# EAGLE design mixer_board_input_and_mute_circuit (EAGLE 9.4.1)
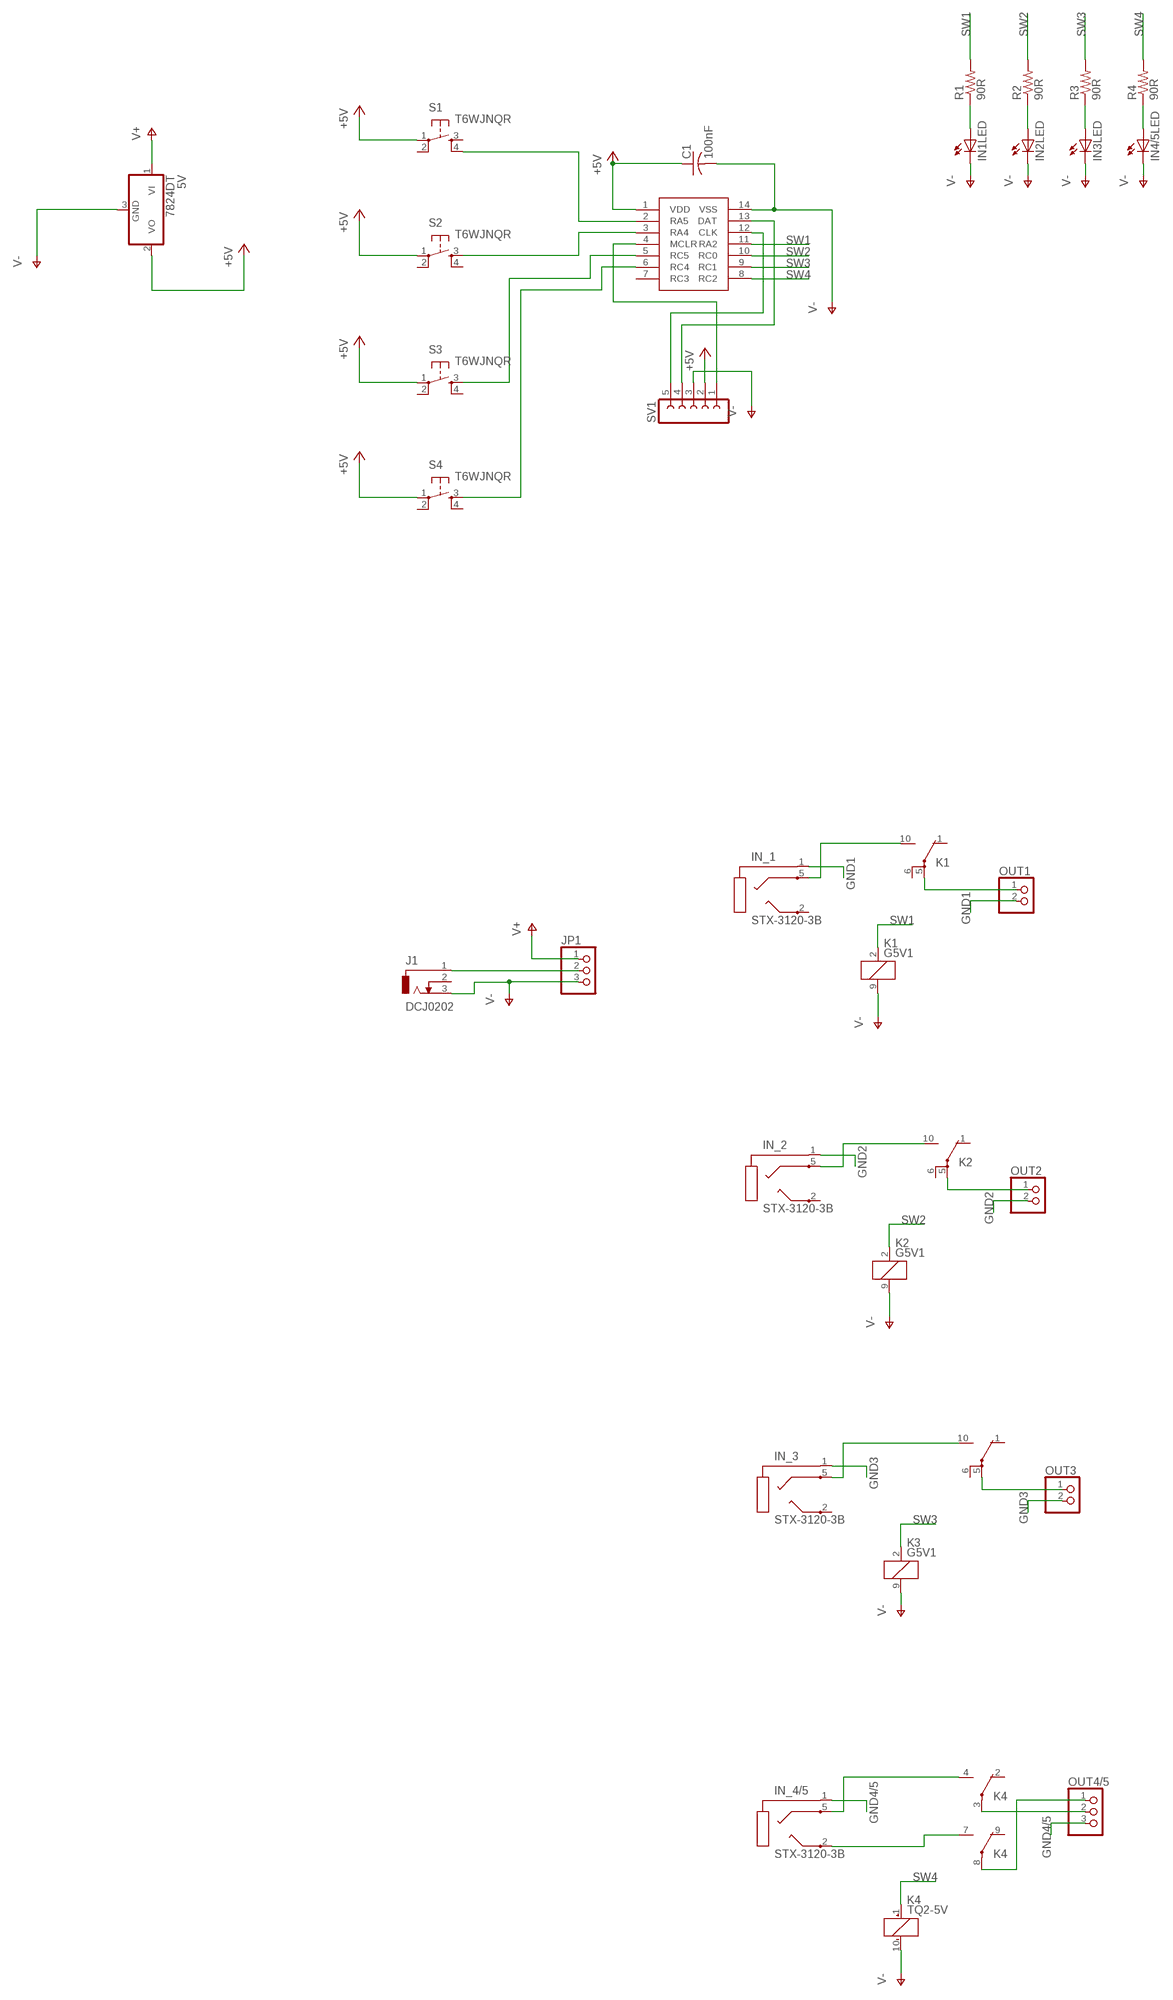
[diagram p0: schematic, sheet 1]

## Parts
5V  7824DT  [TO252]
C1  100nF  C-USC0805  [C0805]
IN1LED  LEDCHIPLED_1206  [CHIPLED_1206]
IN2LED  LEDCHIPLED_1206  [CHIPLED_1206]
IN3LED  LEDCHIPLED_1206  [CHIPLED_1206]
IN4/5LED  LEDCHIPLED_1206  [CHIPLED_1206]
IN_1  STX-3120-3B  [STX-3120]
IN_2  STX-3120-3B  [STX-3120]
IN_3  STX-3120-3B  [STX-3120]
IN_4/5  STX-3120-3B  [STX-3120]
J1  DCJ0202  [DCJ0202]
JP1  PINHD-1X3/90  [1X03/90]
K1  G5V1  [G5V1]
K2  G5V1  [G5V1]
K3  G5V1  [G5V1]
K4  TQ2-5V  [TQ2]
OUT1  PINHD-1X2/90  [1X02/90]
OUT2  PINHD-1X2/90  [1X02/90]
OUT3  PINHD-1X2/90  [1X02/90]
OUT4/5  PINHD-1X3/90  [1X03/90]
R1  90R  R-US_M0805  [M0805]
R2  90R  R-US_M0805  [M0805]
R3  90R  R-US_M0805  [M0805]
R4  90R  R-US_M0805  [M0805]
S1  T6WJNQR  [T6WJ2NGQR]
S2  T6WJNQR  [T6WJ2NGQR]
S3  T6WJNQR  [T6WJ2NGQR]
S4  T6WJNQR  [T6WJ2NGQR]
SV1  FE05-1  [FE05-1]
U1  PIC16F18426  [SO14]

## Nets
+5V: 5V.2(VO) C1.1 S1.1 S2.1 S3.1 S4.1 SV1.2 U1.1(VDD)
GND1: IN_1.1 OUT1.2
GND2: IN_2.1 OUT2.2
GND3: IN_3.1 OUT3.2
GND4/5: IN_4/5.1 OUT4/5.3
N$1: J1.1 JP1.2
N$2: K4.3(1:P) OUT4/5.2
N$3: S1.4 U1.2(RA5)
N$4: S2.3 U1.3(RA4)
N$5: K2.5(2:P) OUT2.1
N$6: K1.5(2:P) OUT1.1
N$7: K3.5(2:P) OUT3.1
N$8: S3.3 U1.5(RC5)
N$9: IN1LED.A R1.1
N$10: S4.3 U1.6(RC4)
N$11: SV1.1 U1.4(MCLR)
N$12: IN_4/5.5 K4.4(1:S)
N$13: IN_4/5.2 K4.7(2:S)
N$14: K4.8(2:P) OUT4/5.1
N$28: IN2LED.A R2.1
N$32: IN3LED.A R3.1
N$34: IN4/5LED.A R4.1
N$40: SV1.4 U1.13(DAT)
N$41: SV1.5 U1.12(CLK)
N$43: IN_3.5 K3.10(2:S)
N$44: IN_2.5 K2.10(2:S)
N$45: IN_1.5 K1.10(2:S)
SW1: K1.2 R1.2 U1.11(RA2)
SW2: K2.2 R2.2 U1.10(RC0)
SW3: K3.2 R3.2 U1.9(RC1)
SW4: K4.1(_:+) R4.2 U1.8(RC2)
V+: 5V.1(VI) JP1.1
V-: 5V.3(GND) C1.2 IN1LED.C IN2LED.C IN3LED.C IN4/5LED.C J1.3 JP1.3 K1.9 K2.9 K3.9 K4.10(_:-) SV1.3 U1.14(VSS)
Unconnected: IN_1.2 IN_2.2 IN_3.2 J1.2 K1.1(2:O) K1.6(2:P) K2.1(2:O) K2.6(2:P) K3.1(2:O) K3.6(2:P) K4.2(1:O) K4.9(2:O) S1.2 S1.3 S2.2 S2.4 S3.2 S3.4 S4.2 S4.4 U1.7(RC3)

## Library data of the parts
5V = linear:78*: Positive VOLTAGE REGULATOR Source: http://cache.national.com/ds/LM/LM78L05.pdf http://www.fairchildsemi.com/ds/LM/LM7805.pdf
C1 = resistor:C-US: CAPACITOR, American symbol
IN1LED IN2LED IN3LED IN4/5LED = led:LED: LED OSRAM: - CHIPLED LG R971, LG N971, LY N971, LG Q971, LY Q971, LO R971, LY R971 LH N974, LH R974 LS Q976, LO Q976, LY Q976 LO Q996 - Hyper CHIPLED LW Q18S LB Q993, LB Q99A, LB R99A - SideLED LS A670, LO A670, LY A670, LG A670, LP A670 LB A673, LV A673, LT A673, LW A673 LH A674 LY A675 LS A676, LA A676, LO A676, LY A676, LW A676 LS A679, LY A679, LG A679 - Hyper Micro SIDELED® LS Y876, LA Y876, LO Y876, LY Y876 LT Y87S - SmartLED LW L88C, LW L88S LB L89C, LB L89S, LG L890 LS L89K, LO L89K, LY L89K LS L896, LA L896, LO L896, LY L896 - TOPLED LS T670, LO T670, LY T670, LG T670, LP T670 LSG T670, LSP T670, LSY T670, LOP T670, LYG T670 LG T671, LOG T671, LSG T671 LB T673, LV T673, LT T673, LW T673 LH T674 LS T676, LA T676, LO T676, LY T676, LB T676, LH T676, LSB T676, LW T676 LB T67C, LV T67C, LT T67C, LS T67K, LO T67K, LY T67K, LW E67C LS E67B, LA E67B, LO E67B, LY E67B, LB E67C, LV E67C, LT E67C LW T67C LS T679, LY T679, LG T679 LS T770, LO T770, LY T770, LG T770, LP T770 LB T773, LV T773, LT T773, LW T773 LH T774 LS E675, LA E675, LY E675, LS T675 LS T776, LA T776, LO T776, LY T776, LB T776 LHGB T686 LT T68C, LB T68C - Hyper Mini TOPLED® LB M676 - Mini TOPLED Santana® LG M470 LS M47K, LO M47K, LY M47K Source: http://www.osram.convergy.de LUXEON: - LUMILED® LXK2-PW12-R00, LXK2-PW12-S00, LXK2-PW14-U00, LXK2-PW14-V00 LXK2-PM12-R00, LXK2-PM12-S00, LXK2-PM14-U00 LXK2-PE12-Q00, LXK2-PE12-R00, LXK2-PE12-S00, LXK2-PE14-T00, LXK2-PE14-U00 LXK2-PB12-K00, LXK2-PB12-L00, LXK2-PB12-M00, LXK2-PB14-N00, LXK2-PB14-P00, LXK2-PB14-Q00 LXK2-PR12-L00, LXK2-PR12-M00, LXK2-PR14-Q00, LXK2-PR14-R00 LXK2-PD12-Q00, LXK2-PD12-R00, LXK2-PD12-S00 LXK2-PH12-R00, LXK2-PH12-S00 LXK2-PL12-P00, LXK2-PL12-Q00, LXK2-PL12-R00 Source: www.luxeon.com KINGBRIGHT: KA-3528ASYC Source: www.kingbright.com
IN_1-IN_3 IN_4/5 = biblib:STX-3120-3B
J1 = con-jack:DCJ0202: DC POWER JACK Source: DCJ0202.pdf; OC_FARNELL: unknown; OC_NEWARK: unknown
JP1 OUT4/5 = pinhead:PINHD-1X3: PIN HEADER
K1-K3 = relay:G5V1: RELAY 1 x switch, 0.5 A/125 V AC, 1 A/24 V DC , Omron; MPN: G5V-1-DC24; OC_FARNELL: 9949593; OC_NEWARK: 36M6377
K4 = relay:TQ2?*: LOW PROFILE 2 FORM C RELAY NAiS Source: http://www.mew-europe.com/.. en_ds_61020_0001.pdf Source: http://www.mew-europe.com/.. en_ds_61020_0004.pdf; MF: AROMAT/ MATSUSHITA; MPN: TQ2-5V; OC_FARNELL: 1175716; OC_NEWARK: 64K3200
OUT1-OUT3 = pinhead:PINHD-1X2: PIN HEADER
R1-R4 = resistor:R-US_: RESISTOR, American symbol
S1-S4 = biblib:T6WJNQR
SV1 = con-lsta:FE05-1: FEMALE HEADER; OC_FARNELL: unknown; OC_NEWARK: unknown
U1 = biblib:PIC16F18426

## Board
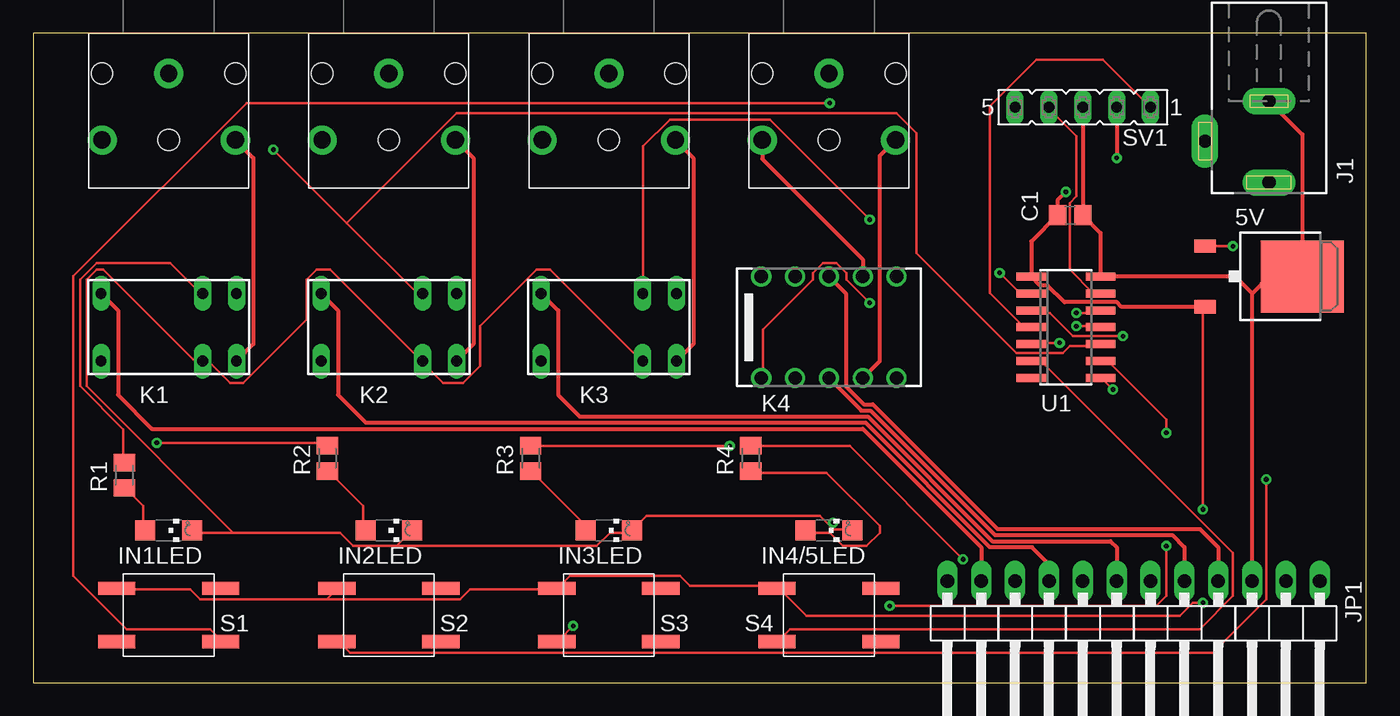
[diagram p1: board, top side]
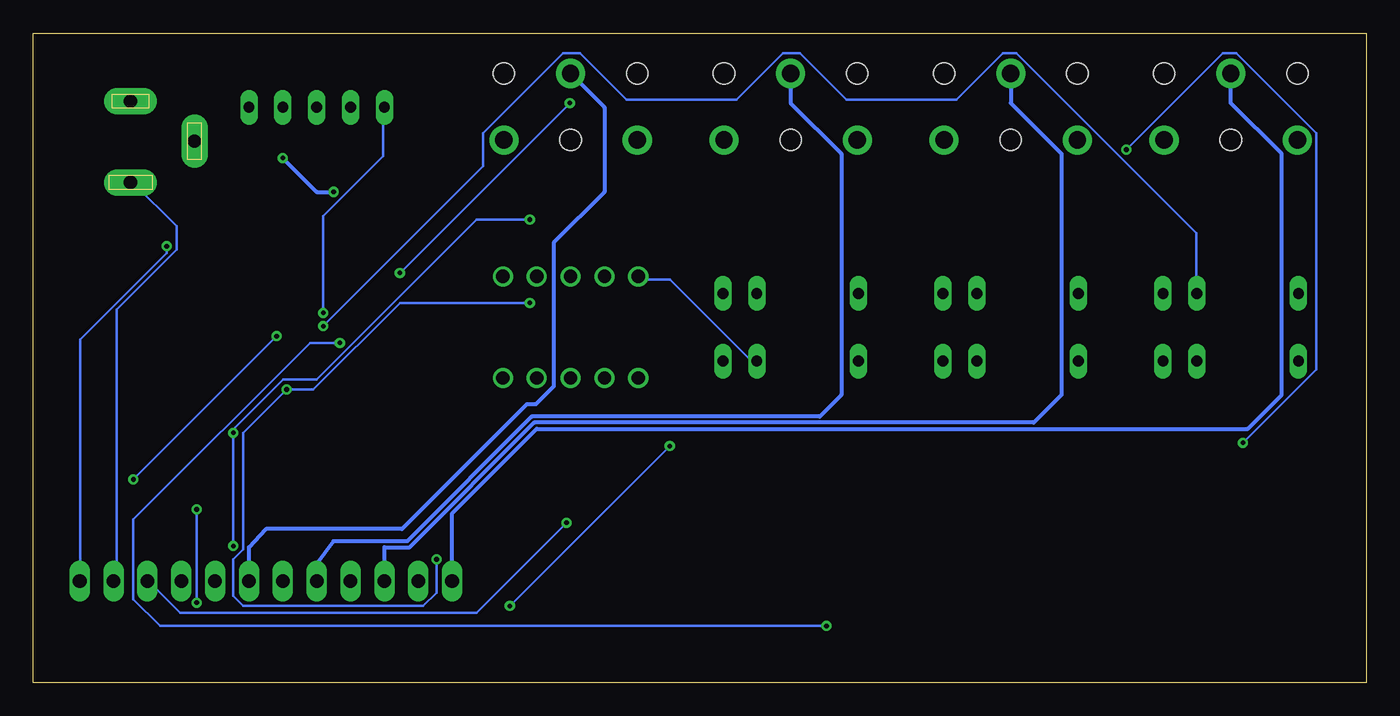
[diagram p2: board, bottom side, seen from below]

Size 100 x 48.73 mm. Coordinates in mm from the lower left corner, seen from the top.
Outline: 0,0 100,0 100,48.73 0,48.73 0,0
Copper layers (1*16): Top 0.035mm / dielectric 1.5mm / Bottom 0.035mm
Design rules "default *": minimum track width 0.2mm, minimum drill 0.35mm, track to track 6mil, track to pad 6mil, pad to pad 6mil, via to via 6mil, smd to smd 6mil, copper to edge 40mil, drill to drill 6mil, minimum pad ring 10mil, minimum via ring 8mil, stop-mask expansion 4mil, vias tented up to drill 0mil, thermal gap 10mil

### Footprints (pad centres in the part's own frame; a part is rotated, then mirrored left to right if it is on the bottom)
TO252 = smd 1 x 1.6: 1 -2.28,-4.8; 2 2.28,-4.8 | smd 5.4 x 6.2: 3 0,2.5
C0805 = smd 1.3 x 1.5: 1 -0.95,0; 2 0.95,0
CHIPLED_1206 = smd 1.5 x 1.5: A 0,-1.75; C 0,1.75
STX-3120 = drill 1.3 pad 2.184: 1 0,0; 2 5,-5; 5 5,5 | hole 1.6: 0,5; 0,-5; 5,0
DCJ0202 = drill 1 pad 2 long: 1 0,3.1; 2 4.8,0; 3 0,-3
1X03/90 = drill 1.016 long: 1 -2.54,-3.81; 2 0,-3.81; 3 2.54,-3.81
G5V1 = drill 0.813 long: 1 -5.08,-2.54; 2 -2.54,-2.54; 5 5.08,-2.54; 6 5.08,2.54; 9 -2.54,2.54; 10 -5.08,2.54
TQ2 = drill 1: 1 -5.08,-3.81; 2 -2.54,-3.81; 3 0,-3.81; 4 2.54,-3.81; 5 5.08,-3.81; 6 5.08,3.81; 7 2.54,3.81; 8 0,3.81; 9 -2.54,3.81; 10 -5.08,3.81
1X02/90 = drill 1.016 long: 1 -1.27,-3.81; 2 1.27,-3.81
M0805 = smd 1.3 x 1.6: 1 -0.95,0; 2 0.95,0
T6WJ2NGQR = smd 2.8 x 1: 1 -3.9,2; 2 3.9,2; 3 -3.9,-2; 4 3.9,-2
FE05-1 = drill 0.813 long: 1 -5.08,0; 2 -2.54,0; 3 0,0; 4 2.54,0; 5 5.08,0
SO14 = smd 0.6 x 2.2: 1 -3.81,-2.6; 2 -2.54,-2.6; 3 -1.27,-2.6; 4 0,-2.6; 5 1.27,-2.6; 6 2.54,-2.6; 7 3.81,-2.6; 8 3.81,2.6; 9 2.54,2.6; 10 1.27,2.6; 11 0,2.6; 12 -1.27,2.6; 13 -2.54,2.6; 14 -3.81,2.6

### Placement (x,y rotation side)
5V  92.71,30.48 270 top
C1  77.79,35.08 0 top
IN1LED  10.16,11.43 270 top
IN2LED  26.67,11.43 270 top
IN3LED  43.18,11.43 270 top
IN4/5LED  59.69,11.43 270 top
IN_1  10.16,45.72 270 top
IN_2  26.67,45.72 270 top
IN_3  43.18,45.72 270 top
IN_4/5  59.69,45.72 270 top
J1  92.71,40.64 180 top
JP1  93.98,3.81 180 top
K1  10.16,26.67 180 top
K2  26.67,26.67 180 top
K3  43.18,26.67 180 top
K4  59.69,26.67 0 top
OUT1  69.85,3.81 180 top
OUT2  74.93,3.81 180 top
OUT3  80.01,3.81 180 top
OUT4/5  86.36,3.81 180 top
R1  6.83,15.56 90 top
R2  22.07,16.83 90 top
R3  37.31,16.83 90 top
R4  53.82,16.83 90 top
S1  10.16,5.08 0 top
S2  26.67,5.08 0 top
S3  43.18,5.08 0 top
S4  59.69,5.08 0 top
SV1  78.74,43.18 180 top
U1  77.47,26.67 270 top

### Tracks (layer width: path | path; a pad name or v marks a point on that pad's centre or on a via)
+5V  (via drill 0.35)
  Top 0.2: 22,6.25 12.5,6.25 11.75,7 6.5,7 S1.1 | 22,6.25 22.75,7 S2.1 | 22,6.25 32,6.25 32.75,7 39.25,7 S3.1 39.5,7.25 40.25,8 48.5,8 49.25,7.25 55.75,7.25 S4.1 56,7 58,5 86,5 87,6 v87.75,6 | v87.75,13 87.75,28 5V.2
  Top 0.305: 5V.2 81.64,28.2 81.3,28.55 77.37,28.55 76.1,29.82 75.53,29.82 U1.1 74.87,33.11 C1.1 76.84,36.2 v77.47,36.83 | SV1.2 v81.28,39.37
  Bottom 0.2: v87.75,6 v87.75,13
  Bottom 0.305: v81.28,39.37 78.74,36.83 v77.47,36.83
GND1
  Bottom 0.305: IN_1.1 10.16,43.5 6.35,39.69 6.35,21.59 8.89,19.05 62.23,19.05 68.58,12.7 OUT1.2
GND2
  Bottom 0.305: IN_2.1 26.67,43.5 22.86,39.69 22.86,21.59 24.94,19.51 62.42,19.51 71.77,10.16 73.66,10.16 OUT2.2
GND3
  Bottom 0.305: IN_3.1 43.18,43.5 39.37,39.69 39.37,21.59 41,19.96 62.61,19.96 71.96,10.62 77.47,10.62 78.74,8.89 OUT3.2
GND4/5
  Bottom 0.305: IN_4/5.1 57.15,43.18 57.15,36.83 60.96,33.02 60.96,22.24 62.32,20.88 62.99,20.88 72.33,11.53 82.55,11.53 83.82,10.16 OUT4/5.3
N$1
  Bottom 0.2: JP1.2 93.75,7.75 93.75,28 89.25,32.5 89.25,34.25 92.5,37.5 J1.1
N$2
  Top 0.305: K4.3 62.13,20.42 62.8,20.42 72.14,11.07 85.45,11.07 86.36,10.16 OUT4/5.2
N$3  (via drill 0.35)
  Top 0.2: v72.5,30.75 74,29.25 74.75,29.25 U1.2 | v59.75,43.5 16,43.5 3,30.5 3,8 7,4 13.25,4 14,3.25 S1.4
  Bottom 0.2: v59.75,43.5 v72.5,30.75
N$4  (via drill 0.35)
  Top 0.2: v81.75,26 78,26 76.25,27.75 75,27.75 U1.3 | v92.5,15.25 92.5,6.25 88.5,2.25 23.75,2.25 23,3 S2.3
  Bottom 0.2: v92.5,15.25 v81.75,26
N$5
  Top 0.305: K2.5 22.86,27.94 22.86,21.59 24.94,19.51 62.42,19.51 71.77,10.16 74.93,10.16 76.2,8.89 OUT2.1
N$6
  Top 0.305: K1.5 6.35,27.94 6.35,21.59 8.89,19.05 62.23,19.05 71.12,10.16 OUT1.1
N$7
  Top 0.305: K3.5 39.37,27.94 39.37,21.59 41,19.96 62.61,19.96 71.96,10.62 80.82,10.62 81.28,10.16 OUT3.1
N$8  (via drill 0.35)
  Top 0.2: v77,25.5 75,25.5 U1.5 | v40.5,4.25 39.5,3.25 S3.3
  Bottom 0.2: v77,25.5 79.25,25.5 92.5,12.25 92.5,6.25 90.5,4.25 v40.5,4.25
N$9
  Top 0.2: IN1LED.A 8.25,11.5 8.25,13.25 7,14.5 R1.1
N$10
  Top 0.2: U1.6 75,24 75.75,24 90,9.75 90,6.5 87.5,4 56.75,4 56,3.25 S4.3
N$11
  Top 0.2: SV1.1 80.25,46.75 75.25,46.75 71.75,43.25 71.75,29.25 74.25,26.75 74.75,26.75 U1.4
N$12
  Top 0.305: K4.4 63.5,24.13 63.5,39.53 IN_4/5.5
N$13
  Top 0.305: IN_4/5.2 54.69,39.29 62.23,31.75 K4.7
N$14
  Top 0.305: K4.8 60.96,29.21 60.96,22.24 62.32,20.88 62.99,20.88 72.33,11.53 87.53,11.53 88.9,10.16 OUT4/5.1
N$28
  Top 0.2: IN2LED.A 24.75,11.5 24.75,13.25 22.25,15.75 R2.1
N$32
  Top 0.2: IN3LED.A 41.25,11.5 41.25,12 37.5,15.75 R3.1
N$34
  Top 0.2: IN4/5LED.A 58,11.25 59.75,11.25 60.75,10.25 62.5,10.25 63.5,11.25 63.5,11.75 59.5,15.75 54,15.75 R4.1
N$40
  Top 0.2: U1.13 80,29.25 79.5,29.25 77.75,31 77.75,36 78.25,36.5 78.25,41 76.25,43 SV1.4
N$41  (via drill 0.35)
  Top 0.2: v78.25,27.75 80,27.75 U1.12
  Bottom 0.2: v78.25,27.75 78.25,35 73.75,39.5 73.75,43 SV1.5
N$43
  Top 0.305: IN_3.5 49.53,39.37 49.53,25.4 K3.10
N$44
  Top 0.305: IN_2.5 33.02,39.37 33.02,25.4 K2.10
N$45
  Top 0.305: IN_1.5 16.51,39.37 16.51,25.4 K1.10
SW1  (via drill 0.35)
  Top 0.2: R1.2 6.75,16.75 6.75,19 3.5,22.25 3.5,30.25 4.75,31.5 10.25,31.5 12.5,29.25 K1.2 | v78.25,26.75 80,26.75 U1.11
  Bottom 0.2: v78.25,26.75 66.25,38.75 66.25,41.25 60.25,47.25 59,47.25 55.5,43.75 47.25,43.75 43.75,47.25 42.5,47.25 39,43.75 30.75,43.75 27.25,47.25 26.25,47.25 12.75,33.75 12.75,29.25 K1.2
SW2  (via drill 0.35)
  Top 0.2: v9.25,18 22,18 R2.2 | 23.5,34.5 29,29 K2.2 | 23.5,34.5 v18,40 | 23.5,34.5 31.75,42.75 64.75,42.75 66.25,41.25 66.25,32.25 73.75,24.75 77.25,24.75 77.75,25.25 80,25.25 U1.10
  Bottom 0.2: v9.25,18 3.75,23.5 3.75,41.25 9.75,47.25 10.75,47.25 v18,40
SW3  (via drill 0.35)
  Top 0.2: v52.25,17.75 37.5,17.75 R3.2 | v64.25,5.75 84.25,5.75 85,6.5 v85,10.25 | v85,18.75 85,19.75 80.75,24 80.25,24 U1.9 | v62.75,34.75 55.25,42.25 47.75,42.25 45.75,40.25 45.75,29.25 K3.2
  Bottom 0.2: v64.25,5.75 v52.25,17.75 | v85,10.25 v85,18.75 85,19 81.25,22.75 78.75,22.75 66.75,34.75 v62.75,34.75
SW4  (via drill 0.35)
  Top 0.2: v69.75,9.25 61.25,17.75 54,17.75 R4.2 | v81,22 80.25,22.75 U1.8 | v62.75,28.5 61,30.25 61,30.75 60.25,31.5 59.25,31.5 58.5,30.75 58.5,30.25 54.75,26.5 54.75,23 K4.1
  Bottom 0.2: v69.75,9.25 69.75,6.75 70.75,5.75 84.25,5.75 85,6.5 85,9.25 84.25,10 84.25,18.75 v81,22 79,22 72.5,28.5 v62.75,28.5
V+  (via drill 0.35)
  Top 0.2: v90,32.75 88,32.75 5V.1
  Bottom 0.2: v90,32.75 90,32.25 96.5,25.75 96.5,7.75 JP1.1
V-  (via drill 0.35)
  Top 0.2: K3.9 45.5,24.25 38.75,31 37.75,31 33.5,26.75 33.5,23.75 32.25,22.5 30.75,22.5 29.25,24 K2.9 29,24.25 22.25,31 21.25,31 20.5,30.25 20.5,27.25 15.75,22.5 14.75,22.5 13.25,24 12.75,24 K1.9 12.5,24.25 12,24.25 5.25,31 4.75,31 4,30.25 4,22.25 15,11.25 | 91.5,7.75 JP1.3 | 15,11.25 23,11.25 24,10.25 27.25,10.25 | 15,11.25 12,11.25 IN1LED.C | 27.25,10.25 28.25,11.25 IN2LED.C | 27.25,10.25 42.25,10.25 43.25,11.25 44.75,11.25 IN3LED.C 46,12.5 59,12.5 59.75,11.75 | 59.75,11.75 60,11.5 61.25,11.5 IN4/5LED.C | 59.75,11.75 v60,12
  Top 0.305: SV1.3 C1.2 80.07,33.75 U1.14 90.17,30.48 91.44,29.21 | J1.3 95.21,41.14 5V.3 92.71,30.48 91.44,29.21 | 91.5,7.75 91.44,7.81 91.44,29.21
  Bottom 0.2: K3.9 45.75,24.25 46.25,24.25 52.25,30.25 54.5,30.25 K4.10 | v60,12 66.75,5.25 89,5.25 91.25,7.5 JP1.3